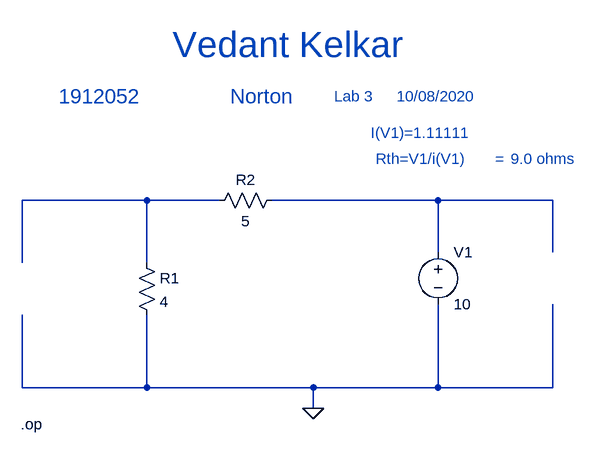
[diagram p0: schematic Draft8.asc]
Draft8.asc, the LTspice schematic file:
Version 4
SHEET 1 880 680
WIRE 0 96 -192 96
WIRE 112 96 0 96
WIRE 448 96 192 96
WIRE 624 96 448 96
WIRE 448 176 448 96
WIRE 624 176 624 96
WIRE -192 192 -192 96
WIRE 0 192 0 96
WIRE -192 384 -192 272
WIRE 0 384 0 272
WIRE 0 384 -192 384
WIRE 256 384 0 384
WIRE 448 384 448 256
WIRE 448 384 256 384
WIRE 624 384 624 256
WIRE 624 384 448 384
WIRE 256 416 256 384
FLAG 256 416 0
SYMBOL res -16 176 R0
SYMATTR InstName R1
SYMATTR Value 4
SYMBOL res 208 80 R90
WINDOW 0 0 56 VBottom 2
WINDOW 3 32 56 VTop 2
SYMATTR InstName R2
SYMATTR Value 5
SYMBOL voltage 448 160 R0
WINDOW 123 0 0 Left 0
WINDOW 39 0 0 Left 0
SYMATTR InstName V1
SYMATTR Value 10
TEXT 40 -144 Left 5 ;Vedant Kelkar
TEXT -136 -64 Left 3 ;1912052
TEXT 128 -64 Left 3 ;Norton
TEXT 288 -64 Left 2 ;Lab 3
TEXT 384 -64 Left 2 ;10/08/2020
TEXT -194 440 Left 2 !.op
TEXT 344 -8 Left 2 ;I(V1)=1.11111
TEXT 352 32 Left 2 ;Rth=V1/i(V1)
TEXT 560 32 Left 2 ;9.0
TEXT 600 32 Left 2 ;ohms
TEXT 536 32 Left 2 ;=

The netlist it stands for:
* Draft8.asc
R1 N001 0 4
R2 N002 N001 5
V1 N002 0 10
* Vedant Kelkar
* 1912052
* Norton
* Lab 3
* 10/08/2020
.op
* I(V1)=1.11111
* Rth=V1/i(V1)
* 9.0
* ohms
* =
.backanno
.end